# EAGLE design motherboard (EAGLE 9.5.1)
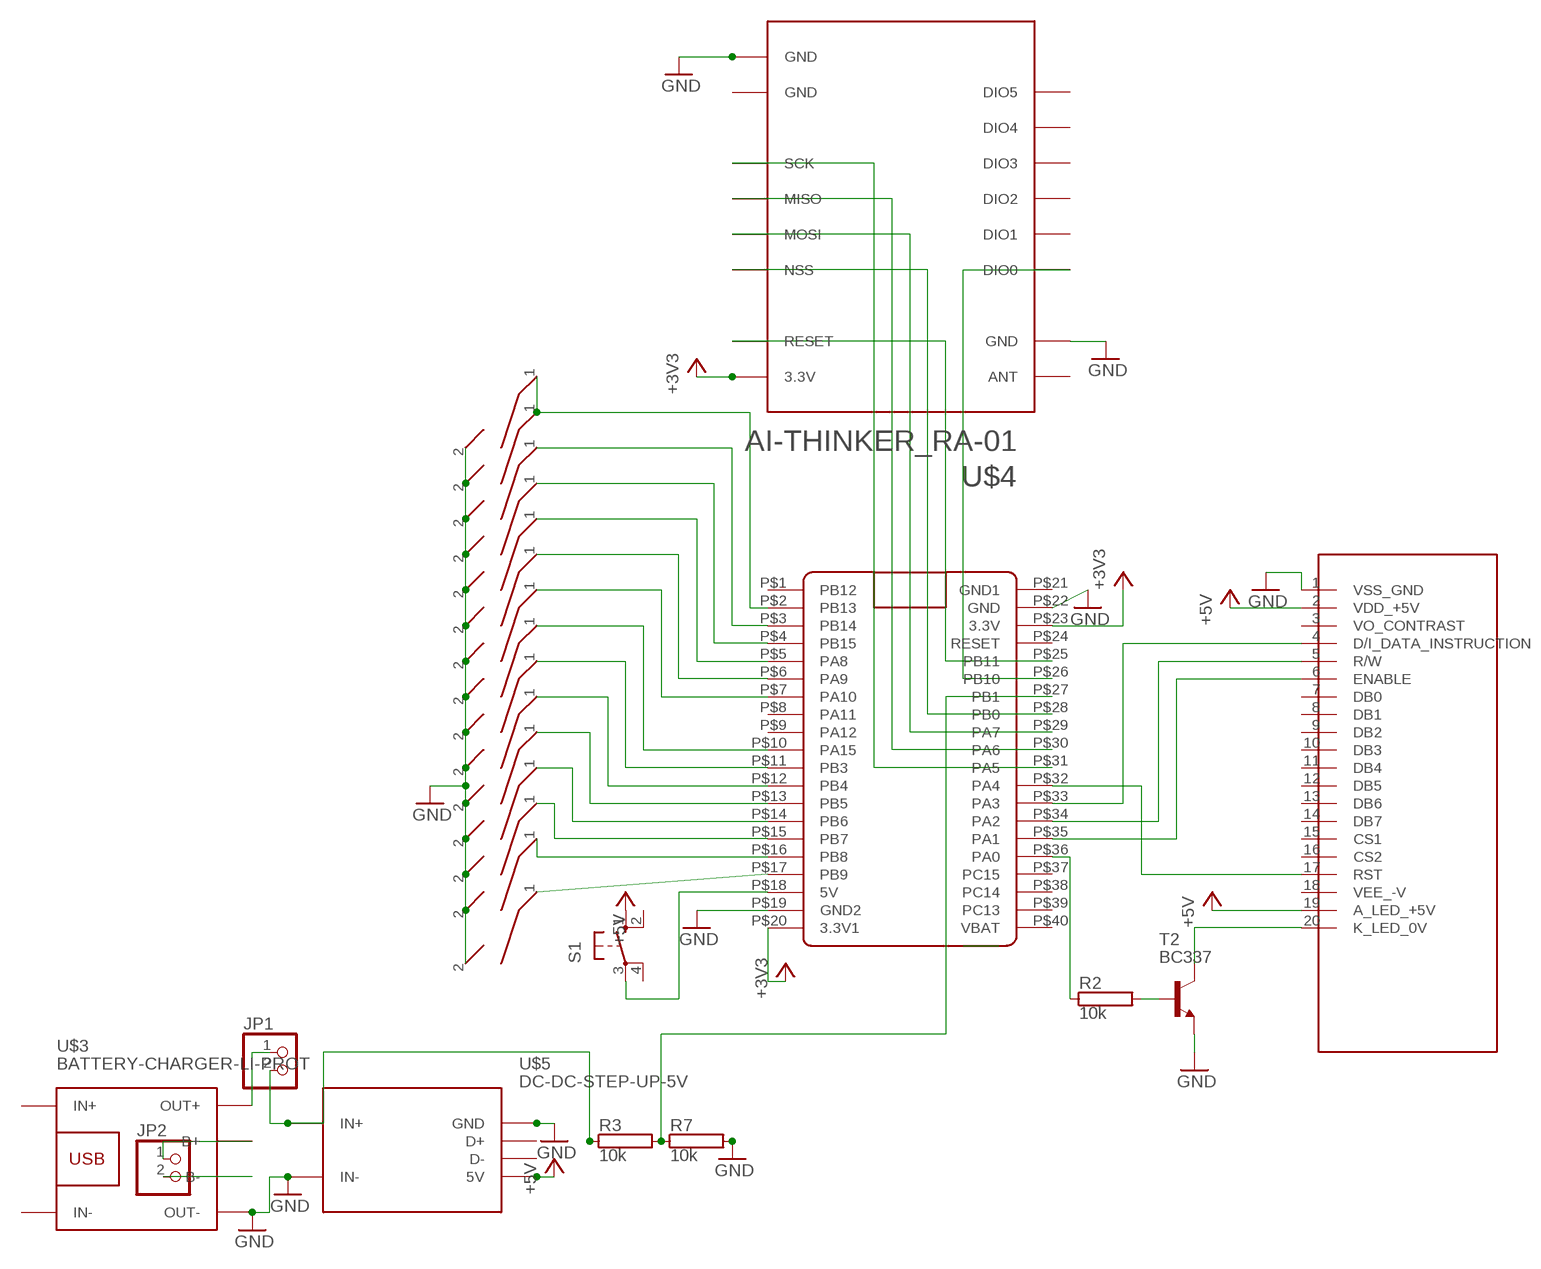
[diagram p0: schematic, sheet 1]

## Parts
JP1  PINHD-1X2/90  [1X02/90]
JP2  PINHD-1X2/90  [1X02/90]
R2  10k  RAC01  [AC01]
R3  10k  RAC01  [AC01]
R7  10k  RAC01  [AC01]
S1  10-XX  [B3F-10XX]
SW1  CHERRY_MX  [MX1A-XXNN]
SW2  CHERRY_MX  [MX1A-XXNN]
SW3  CHERRY_MX  [MX1A-XXNN]
SW4  CHERRY_MX  [MX1A-XXNN]
SW5  CHERRY_MX  [MX1A-XXNN]
SW6  CHERRY_MX  [MX1A-XXNN]
SW7  CHERRY_MX  [MX1A-XXNN]
SW8  CHERRY_MX  [MX1A-XXNN]
SW9  CHERRY_MX  [MX1A-XXNN]
SW10  CHERRY_MX  [MX1A-XXNN]
SW11  CHERRY_MX  [MX1A-XXNN]
SW12  CHERRY_MX  [MX1A-XXNN]
SW13  CHERRY_MX  [MX1A-XXNN]
SW14  CHERRY_MX  [MX1A-XXNN]
SW15  CHERRY_MX  [MX1A-XXNN]
T2  BC337  [TO92]
U$1  W12864  [W12864]
U$2  BLUE_PILL  [BLUE_PILL]
U$3  BATTERY-CHARGER-LI-PROT  [BATTERY-CHARGER-LI-PROT]
U$4  AI-THINKER_RA-01  [AI-THINKER_RA-01]
U$5  DC-DC-STEP-UP-5V  [DC-DC-STEP-UP-5V]

## Nets
+3V3: U$2.P$20(3.3V1) U$2.P$23(3.3V) U$4.P$3(3.3V)
+5V: S1.1(S) U$1.2(VDD_+5V) U$1.19(A_LED_+5V) U$5.5V
GND: R7.2 SW1.2 SW2.2 SW3.2 SW4.2 SW5.2 SW6.2 SW7.2 SW8.2 SW9.2 SW10.2 SW11.2 SW12.2 SW13.2 SW14.2 SW15.2 T2.1(E) U$1.1(VSS_GND) U$2.P$19(GND2) U$2.P$22(GND) U$3.OUT- U$4.P$2(GND) U$4.P$16(GND) U$5.GND U$5.IN-
N$1: JP1.1 U$3.OUT+
N$3: U$2.P$25(PB11) U$4.P$4(RESET)
N$4: U$2.P$28(PB0) U$4.P$15(NSS)
N$5: U$2.P$29(PA7) U$4.P$14(MOSI)
N$6: U$2.P$30(PA6) U$4.P$13(MISO)
N$7: U$2.P$31(PA5) U$4.P$12(SCK)
N$8: U$2.P$26(PB10) U$4.P$5(DIO0)
N$9: U$1.6(ENABLE) U$2.P$35(PA1)
N$10: U$1.5(R/W) U$2.P$34(PA2)
N$11: U$1.17(RST) U$2.P$32(PA4)
N$12: U$1.4(D/I_DATA_INSTRUCTION) U$2.P$33(PA3)
N$13: R2.2 T2.2(B)
N$14: T2.3(C) U$1.20(K_LED_0V)
N$15: SW1.1 U$2.P$17(PB9)
N$16: JP1.2 R3.1 U$5.IN+
N$17: SW2.1 U$2.P$16(PB8)
N$18: R2.1 U$2.P$36(PA0)
N$19: SW3.1 U$2.P$15(PB7)
N$20: SW4.1 U$2.P$14(PB6)
N$21: SW5.1 U$2.P$13(PB5)
N$22: SW6.1 U$2.P$12(PB4)
N$23: SW7.1 U$2.P$11(PB3)
N$24: R3.2 R7.1 U$2.P$27(PB1)
N$25: SW8.1 U$2.P$10(PA15)
N$26: SW9.1 U$2.P$7(PA10)
N$27: SW10.1 U$2.P$6(PA9)
N$28: SW13.1 U$2.P$3(PB14)
N$29: SW14.1 SW15.1 U$2.P$2(PB13)
N$30: SW11.1 U$2.P$5(PA8)
N$31: SW12.1 U$2.P$4(PB15)
N$32: JP2.1 U$3.B+
N$33: JP2.2 U$3.B-
N$34: S1.3(P) U$2.P$18(5V)
Unconnected: S1.2(S1) S1.4(P1) U$1.3(VO_CONTRAST) U$1.7(DB0) U$1.8(DB1) U$1.9(DB2) U$1.10(DB3) U$1.11(DB4) U$1.12(DB5) U$1.13(DB6) U$1.14(DB7) U$1.15(CS1) U$1.16(CS2) U$1.18(VEE_-V) U$2.P$1(PB12) U$2.P$8(PA11) U$2.P$9(PA12) U$2.P$24(RESET) U$2.P$37(PC15) U$2.P$38(PC14) U$2.P$39(PC13) U$2.P$40(VBAT) U$3.IN+ U$3.IN- U$4.P$1(ANT) U$4.P$6(DIO1) U$4.P$7(DIO2) U$4.P$8(DIO3) U$4.P$9(GND) U$4.P$10(DIO4) U$4.P$11(DIO5) U$5.D+ U$5.D-

## Power pins joined to a net without a drawn wire
GND1: U$2.P$21(GND1)

## Library data of the parts
JP1 JP2 = pinhead:PINHD-1X2: PIN HEADER
R2 R3 R7 = resistor-power:R: Power Resitor; OC_FARNELL: unknown; OC_NEWARK: unknown
S1 = switch-omron:10-XX: OMRON SWITCH; MPN: B3F-1000; OC_FARNELL: 176432; OC_NEWARK: 36M3542
SW1-SW15 = Cherry_MX_v7.0:CHERRY_MX
T2 = transistor:BC337: NPN TRANSISTOR
U$1 = ST7920 w12864:W12864
U$2 = BluePill:BLUE_PILL
U$3 = diy-modules:BATTERY-CHARGER-LI-PROT: Lithium Battery 5V Charger with protection circuit More details available here: http://www.instructables.com/id/DIY-Lithium-ion-Battery-Charger/step4/TP4056-based-lithium-ion-battery-charger-module/ Click here to find device on ebay.com <http://www.ebay.com/sch/tp4056+charger+usb+protection>
U$4 = lora-ra-02-minimal-because-labels-fuckup-rotating:AI-THINKER_RA-01
U$5 = 5v-step-up-minimal:DC-DC-STEP-UP-5V: DC/DC Step-Up Converter

## Board
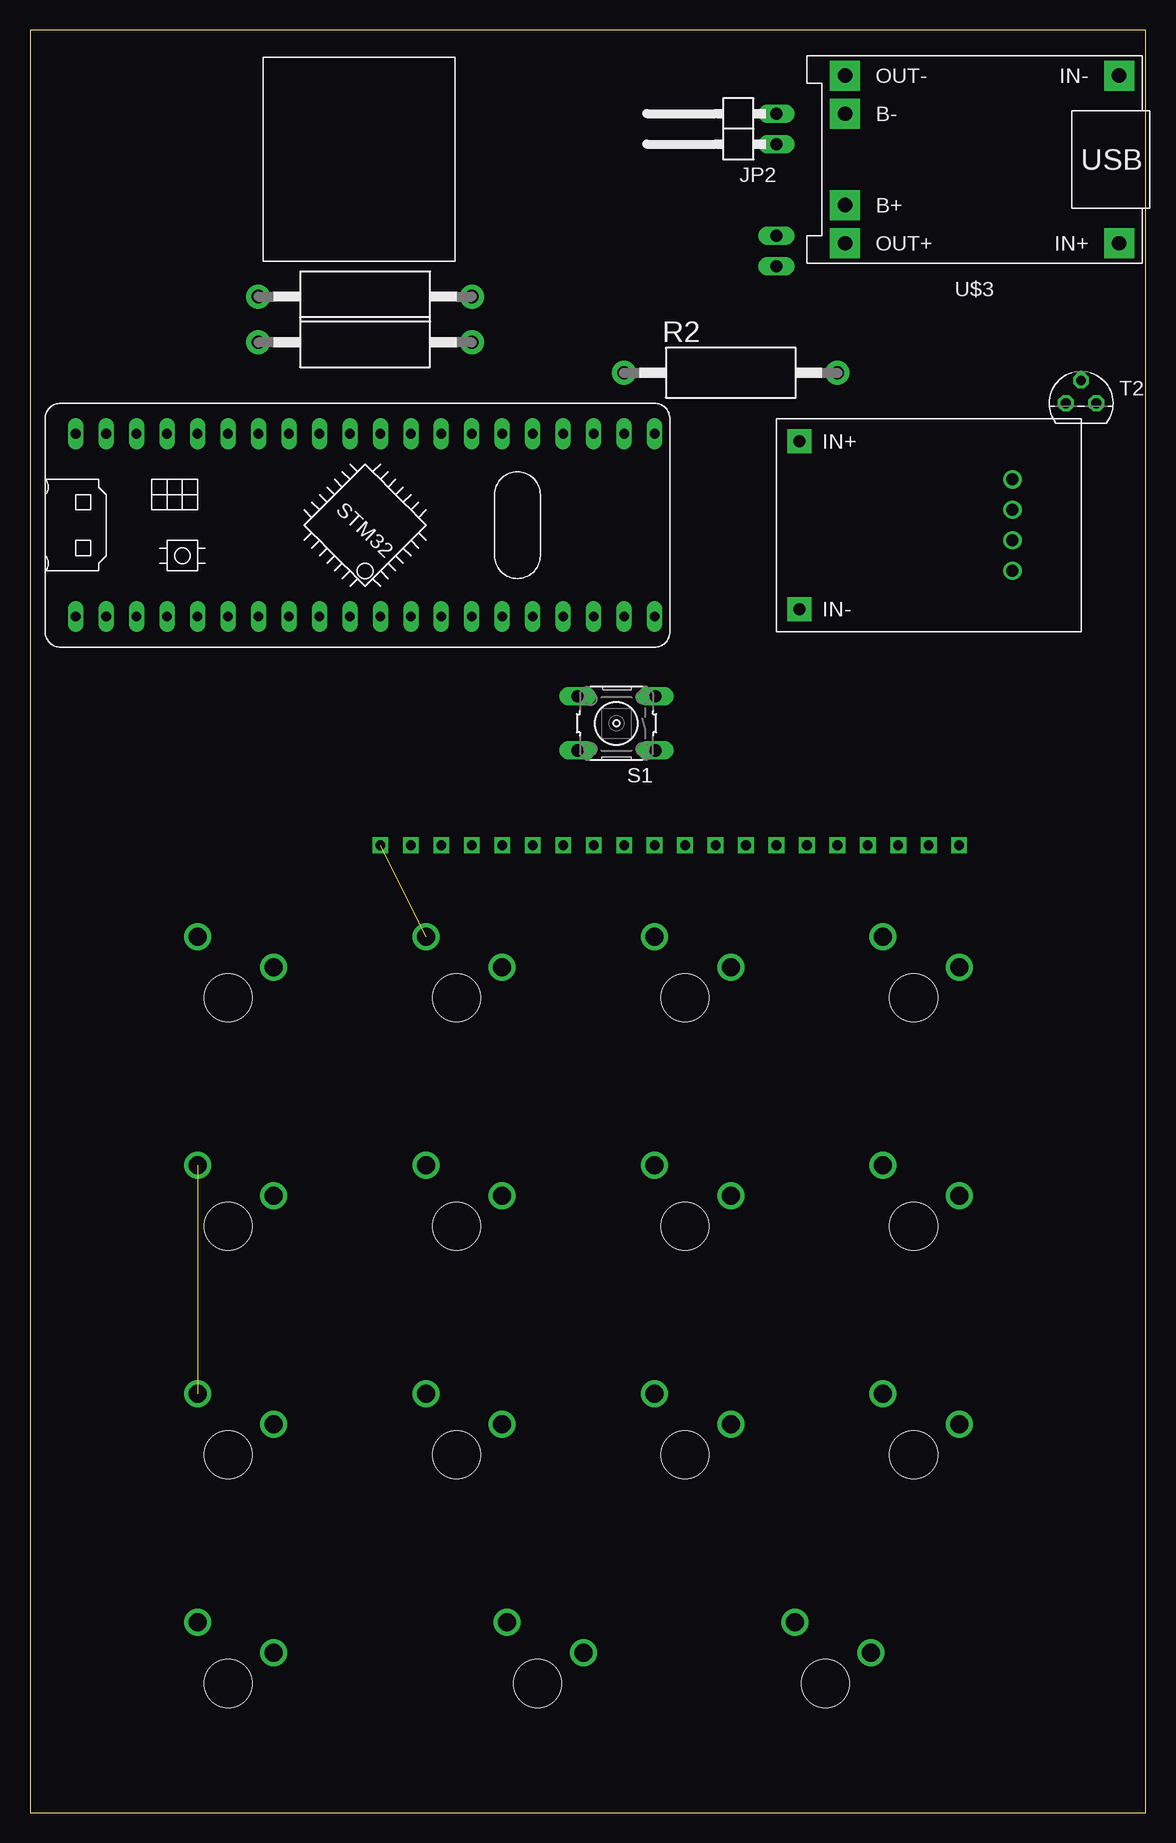
[diagram p1: board, top side]
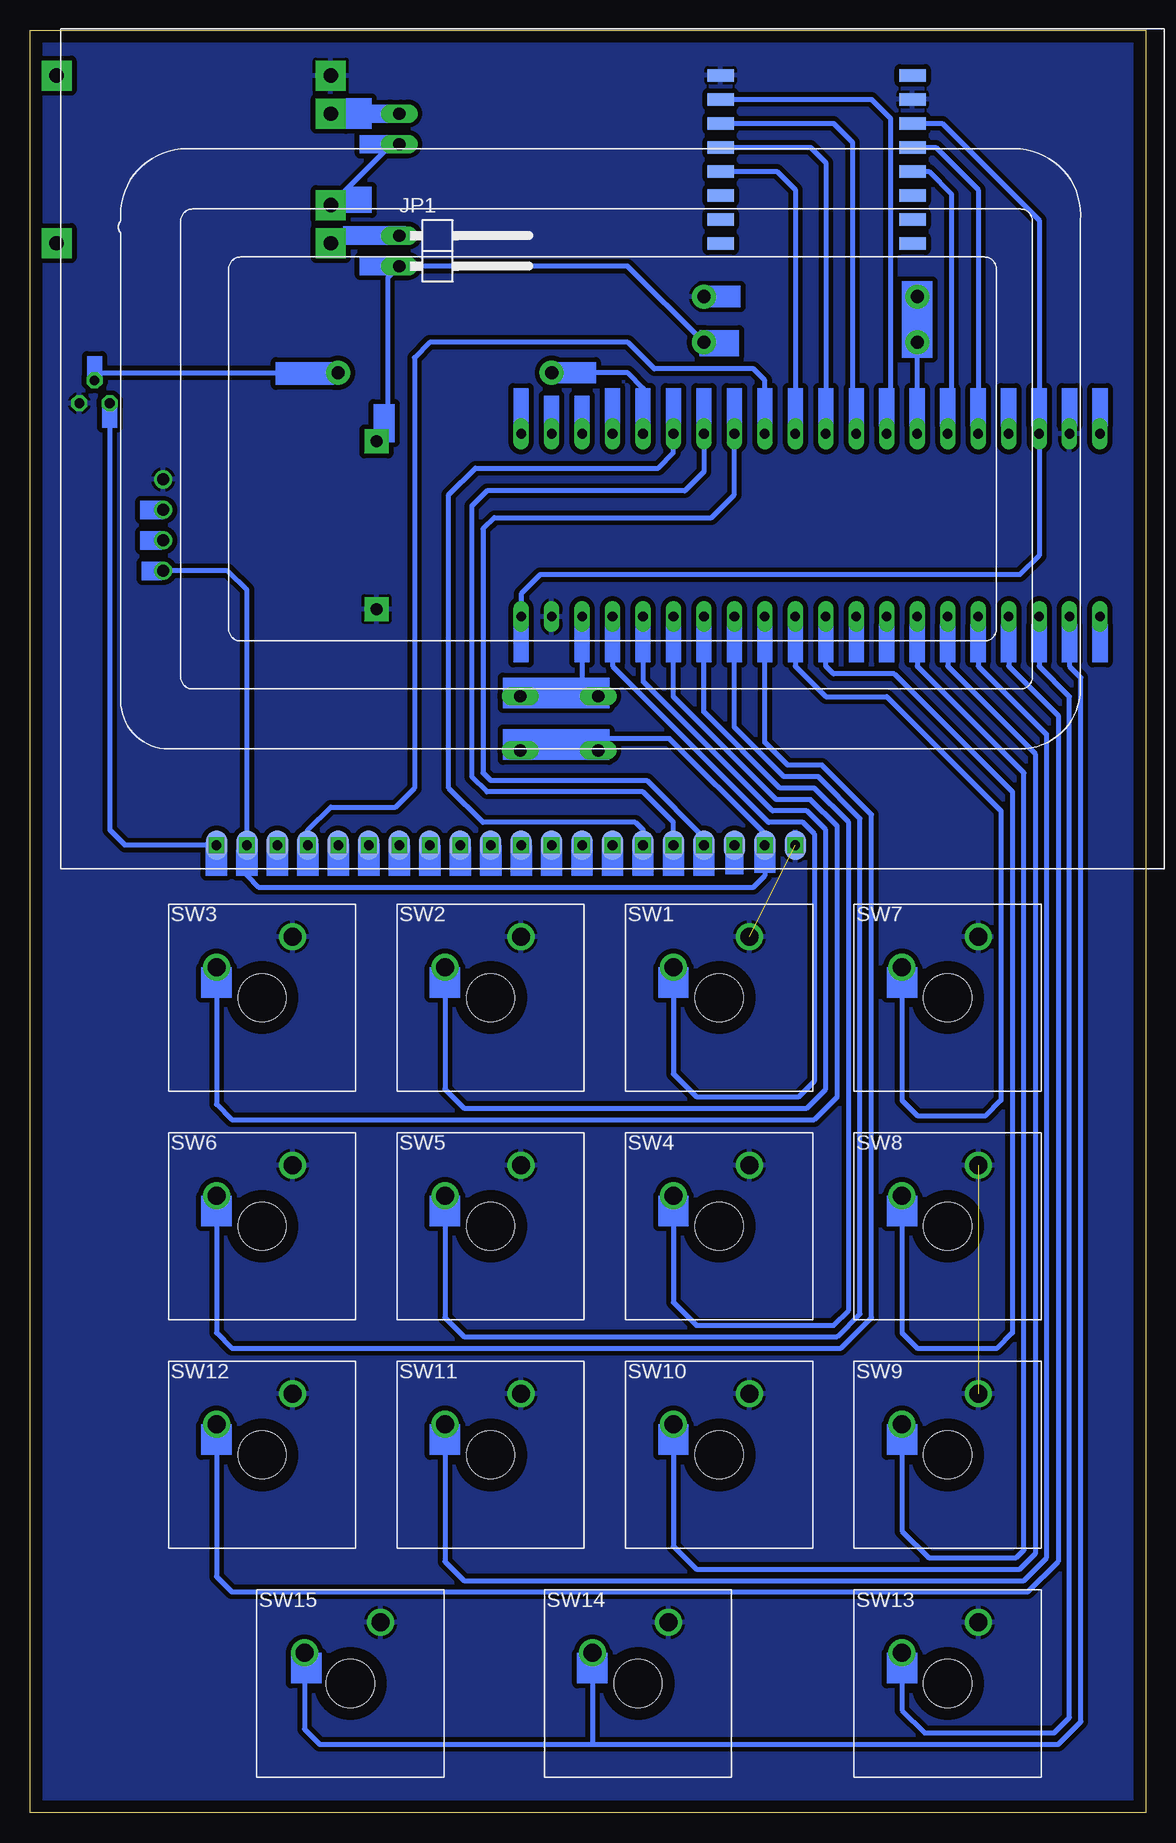
[diagram p2: board, bottom side, seen from below]

Size 93.02 x 148.58 mm. Coordinates in mm from the lower left corner, seen from the top.
Outline: 0,0 93.02,0 93.02,148.58 0,148.58 0,0
Copper layers (1*16): Top 0.035mm / dielectric 1.5mm / Bottom 0.035mm
Design rules "default *": minimum track width 6mil, minimum drill 0.35mm, track to track 16mil, track to pad 16mil, pad to pad 16mil, via to via 16mil, smd to smd 12mil, copper to edge 40mil, drill to drill 6mil, minimum pad ring 10mil, minimum via ring 8mil, stop-mask expansion 4mil, vias tented up to drill 0mil, thermal gap 10mil

### Footprints (pad centres in the part's own frame; a part is rotated, then mirrored left to right if it is on the bottom)
1X02/90 = drill 1.016 long: 1 -1.27,-3.81; 2 1.27,-3.81
AC01 = drill 1.1 pad 2: 1 -8.9,0; 2 8.9,0
B3F-10XX = drill 1.016 long: 1 -3.251,2.261; 2 3.251,2.261; 3 -3.251,-2.261; 4 3.251,-2.261
MX1A-XXNN = drill 1.5: 1 -3.81,2.54; 2 2.54,5.08 | hole 4: 0,0
TO92 = drill 0.813 octagon: 1 1.27,0; 2 0,1.905; 3 -1.27,0
W12864 = smd 1.8 x 2.5: 1 15.24,-33.02; 2 12.7,-33.02; 02 12.7,-33.02; 3 10.16,-33.02; 4 7.62,-33.02; 5 5.08,-33.02; 6 2.54,-33.02; 7 0,-33.02; 8 -2.54,-33.02; 9 -5.08,-33.02; 10 -7.62,-33.02; 11 -10.16,-33.02; 12 -12.7,-33.02; 13 -15.24,-33.02; 14 -17.78,-33.02; 15 -20.32,-33.02; 16 -22.86,-33.02; 17 -25.4,-33.02; 18 -27.94,-33.02; 19 -30.48,-33.02; 20 -33.02,-33.02 | drill 0.8 square: P$1 15.24,-33.02; P$2 -33.02,-33.02; P$3 -30.48,-33.02; P$4 -27.94,-33.02; P$5 -25.4,-33.02; P$6 -22.86,-33.02; P$7 -20.32,-33.02; P$8 -17.78,-33.02; P$9 -15.24,-33.02; P$10 -12.7,-33.02; P$11 -10.16,-33.02; P$12 -7.62,-33.02; P$13 -5.08,-33.02; P$14 -2.54,-33.02; P$15 0,-33.02; P$16 2.54,-33.02; P$17 5.08,-33.02; P$18 7.62,-33.02; P$19 10.16,-33.02; P$20 12.7,-33.02
BLUE_PILL = drill 0.8 long: P$1 -7.62,15.24; P$2 -7.62,12.7; P$3 -7.62,10.16; P$4 -7.62,7.62; P$5 -7.62,5.08; P$6 -7.62,2.54; P$7 -7.62,0; P$8 -7.62,-2.54; P$9 -7.62,-5.08; P$10 -7.62,-7.62; P$11 -7.62,-10.16; P$12 -7.62,-12.7; P$13 -7.62,-15.24; P$14 -7.62,-17.78; P$15 -7.62,-20.32; P$16 -7.62,-22.86; P$17 -7.62,-25.4; P$18 -7.62,-27.94; P$19 -7.62,-30.48; P$20 -7.62,-33.02; P$21 7.62,15.24; P$22 7.62,12.7; P$23 7.62,10.16; P$24 7.62,7.62; P$25 7.62,5.08; P$26 7.62,2.54; P$27 7.62,0; P$28 7.62,-2.54; P$29 7.62,-5.08; P$30 7.62,-7.62; P$31 7.62,-10.16; P$32 7.62,-12.7; P$33 7.62,-15.24; P$34 7.62,-17.78; P$35 7.62,-20.32; P$36 7.62,-22.86; P$37 7.62,-25.4; P$38 7.62,-27.94; P$39 7.62,-30.48; P$40 7.62,-33.02
BATTERY-CHARGER-LI-PROT = drill 1.2 pad 2.5 square: B+ 10.795,3.81; B- 10.795,-3.81; IN+ -12.065,6.985; IN- -12.065,-6.985; OUT+ 10.795,6.985; OUT- 10.795,-6.985
AI-THINKER_RA-01 = smd 2.184 x 1.067 bottom: P$1 -8,7; P$2 -8,5; P$3 -8,3; P$4 -8,1; P$5 -8,-1; P$6 -8,-3; P$7 -8,-5; P$8 -8,-7; P$9 8,-7; P$10 8,-5; P$11 8,-3; P$12 8,-1; P$13 8,1; P$14 8,3; P$15 8,5; P$16 8,7
DC-DC-STEP-UP-5V = drill 1: 5V 6.985,-3.81; D+ 6.985,1.27; D- 6.985,-1.27; GND 6.985,3.81 | drill 1 pad 2 square: IN+ -10.795,6.985; IN- -10.795,-6.985

### Placement (x,y rotation side)
JP1  58.42,130.18 270 bottom
JP2  58.42,140.34 90 top
R2  58.42,120.02 0 top
R3  27.94,122.56 180 top
R7  27.94,126.36 0 top
S1  48.9,90.81 180 top
SW1  35.56,67.95 0 bottom
SW2  54.61,67.95 0 bottom
SW3  73.66,67.95 0 bottom
SW4  35.56,48.9 0 bottom
SW5  54.61,48.9 0 bottom
SW6  73.66,48.9 0 bottom
SW7  16.51,67.95 0 bottom
SW8  16.51,48.9 0 bottom
SW9  16.51,29.85 0 bottom
SW10  35.56,29.85 0 bottom
SW11  54.61,29.85 0 bottom
SW12  73.66,29.85 0 bottom
SW13  16.51,10.79 0 bottom
SW14  42.32,10.79 0 bottom
SW15  66.31,10.79 0 bottom
T2  87.63,117.47 0 top
U$1  44.45,113.67 0 bottom
U$2  19.05,107.31 90 top
U$3  78.74,137.79 180 top
U$4  27.43,137.79 0 top
U$5  74.93,107.31 0 top

### Tracks (layer width: path | path; a pad name or v marks a point on that pad's centre or on a via)
+3V3
  Bottom 0.406: U$2.P$20 52.07,101.6 50.48,103.19 10.48,103.19 8.89,104.78 U$2.P$23 8.89,132.72 16.97,140.79 U$4.P$3
+5V
  Bottom 0.406: U$5.5V 76.52,103.5 74.93,101.92 U$1.19 74.93,78.11 73.98,77.15 32.7,77.15 31.75,78.11 U$1.2 31.75,81.6 39.69,89.53 51.16,89.53 S1.1
GND  (2 unrouted)
  pour Bottom: 0,150.5 93.98,150.5 93.98,0 0,0
N$1
  Bottom 0.406: JP1.1 67.31,131.44 U$3.OUT+
N$3
  Bottom 0.406: U$4.P$4 17.51,138.79 13.97,135.25 U$2.P$25
N$4
  Bottom 0.406: U$4.P$15 22.86,142.79 21.27,141.21 21.27,115.25 U$2.P$28
N$5
  Bottom 0.406: U$4.P$14 26.04,140.79 24.45,139.21 24.45,115.25 U$2.P$29
N$6
  Bottom 0.406: U$4.P$13 27.94,138.79 26.67,137.53 U$2.P$30
N$7
  Bottom 0.406: U$4.P$12 30.75,136.79 29.21,135.25 U$2.P$31
N$8
  Bottom 0.406: U$4.P$5 18.1,136.79 16.19,134.89 16.19,115.25 U$2.P$26
N$9
  Bottom 0.406: U$2.P$35 39.37,113.35 40.64,112.08 55.88,112.08 58.1,109.86 58.1,85.41 55.25,82.55 42.55,82.55 41.91,81.92 U$1.6
N$10
  Bottom 0.406: U$2.P$34 36.83,111.76 38.42,110.17 54.93,110.17 56.2,108.9 56.2,86.36 54.93,85.09 41.91,85.09 39.37,82.55 U$1.5
N$11
  Bottom 0.406: U$1.17 69.85,81.92 67.94,83.82 62.55,83.82 60.96,85.41 60.96,121.28 59.69,122.56 43.18,122.56 40.96,120.33 32.7,120.33 31.75,119.38 U$2.P$32
N$12
  Bottom 0.406: U$2.P$33 34.29,109.86 36.2,107.95 54.29,107.95 55.25,107 55.25,86.68 54.61,86.04 41.59,86.04 36.83,81.28 U$1.4
N$13
  Bottom 0.406: T2.2 87.63,120.02 71.12,120.02 69.85,120.02 R2.2
N$14
  Bottom 0.406: T2.3 86.36,81.92 85.09,80.64 U$1.20
N$15
  Bottom 0.406: SW1.1 39.37,61.59 37.47,59.69 28.89,59.69 27.62,60.96 27.62,81.6 28.57,82.55 31.43,82.55 44.45,95.57 U$2.P$17
N$16
  Bottom 0.406: R3.1 43.19,128.91 JP1.2 63.18,127.95 63.18,115.25 U$5.IN+
N$17
  Bottom 0.406: SW2.1 58.42,60.33 56.83,58.74 28.26,58.74 26.67,60.33 26.67,81.92 28.26,83.5 31.11,83.5 41.91,94.3 U$2.P$16
N$18
  Bottom 0.406: R2.1 43.17,120 41.91,118.75 U$2.P$36
N$19
  Bottom 0.406: SW3.1 77.47,59.05 76.2,57.79 27.62,57.79 25.72,59.69 25.72,82.23 27.94,84.45 30.8,84.45 39.37,93.03 U$2.P$15
N$20
  Bottom 0.406: SW4.1 39.37,42.55 37.47,40.64 26.04,40.64 24.77,41.91 24.77,82.55 27.62,85.41 30.48,85.41 36.83,91.76 U$2.P$14
N$21
  Bottom 0.406: SW5.1 58.42,41.27 56.83,39.69 25.72,39.69 23.81,41.59 23.81,82.87 27.3,86.36 30.16,86.36 34.29,90.49 U$2.P$13
N$22
  Bottom 0.406: SW6.1 77.47,40.01 76.2,38.73 25.4,38.73 22.86,41.27 22.86,83.19 26.99,87.31 29.84,87.31 31.75,89.22 U$2.P$12
N$23
  Bottom 0.406: SW7.1 20.32,59.37 19.05,58.1 13.33,58.1 12.06,59.37 12.06,83.5 21.59,93.03 26.67,93.03 29.21,95.57 U$2.P$11
N$24
  Bottom 0.406: U$2.P$27 R3.2 R7.1
N$25
  Bottom 0.406: SW8.1 20.32,40.01 19.05,38.73 12.38,38.73 11.11,40.01 11.11,85.09 20.95,94.93 26.04,94.93 26.67,95.57 U$2.P$10
N$26
  Bottom 0.406: SW9.1 20.32,23.5 18.1,21.27 10.79,21.27 10.16,21.91 10.16,86.68 19.05,95.57 U$2.P$7
N$27
  Bottom 0.406: SW10.1 39.37,22.23 37.47,20.32 10.48,20.32 9.21,21.59 9.21,88.27 16.51,95.57 U$2.P$6
N$28
  Bottom 0.406: SW13.1 20.32,8.57 18.41,6.67 7.62,6.67 6.35,7.94 6.35,93.03 8.89,95.57 U$2.P$3
N$29
  Bottom 0.406: SW15.1 70.12,6.99 68.85,5.71 68.26,5.71 46.13,5.71 | SW14.1 46.13,5.71 | 46.13,5.71 7.3,5.71 5.4,7.62 5.4,94.61 6.35,95.57 U$2.P$2
N$30
  Bottom 0.406: SW11.1 58.42,20.96 56.83,19.37 10.16,19.37 8.26,21.27 8.26,89.85 13.97,95.57 U$2.P$5
N$31
  Bottom 0.406: SW12.1 77.47,19.69 76.2,18.42 9.84,18.42 7.3,20.96 7.3,91.44 11.43,95.57 U$2.P$4
N$32
  Bottom 0.406: JP2.1 62.87,139.06 U$3.B+
N$33
  Bottom 0.406: JP2.2 U$3.B-
N$34  (1 unrouted)
  Bottom 0.406: S1.3 46.99,93.07 U$2.P$18
N$35  (via drill 2.03 pad 3.84)
  other vias: 16.51,67.95
N$36  (via drill 2.03 pad 3.84)
  other vias: 35.56,67.95
N$37  (via drill 2.03 pad 3.84)
  other vias: 54.61,67.95
N$38  (via drill 2.03 pad 3.84)
  other vias: 16.51,48.9
N$39  (via drill 2.03 pad 3.84)
  other vias: 35.56,48.9
N$40  (via drill 2.03 pad 3.84)
  other vias: 54.61,48.9
N$41  (via drill 2.03 pad 3.84)
  other vias: 16.51,29.85
N$42  (via drill 2.03 pad 3.84)
  other vias: 35.56,29.85
N$43  (via drill 2.03 pad 3.84)
  other vias: 54.61,29.85
N$44  (via drill 2.03 pad 3.84)
  other vias: 16.51,10.79
N$45  (via drill 2.03 pad 3.84)
  other vias: 42.23,10.79
N$46  (via drill 2.03 pad 3.84)
  other vias: 66.36,10.79
N$47  (via drill 2.03 pad 3.84)
  other vias: 73.66,29.85
N$48  (via drill 2.03 pad 3.84)
  other vias: 73.66,48.9
N$49  (via drill 2.03 pad 3.84)
  other vias: 73.66,67.95
(copper drawn outside any net)
  shapes: Bottom area x92